# EAGLE design Grove Base Shield for NodeMCU v1.0 (EAGLE 6.4)
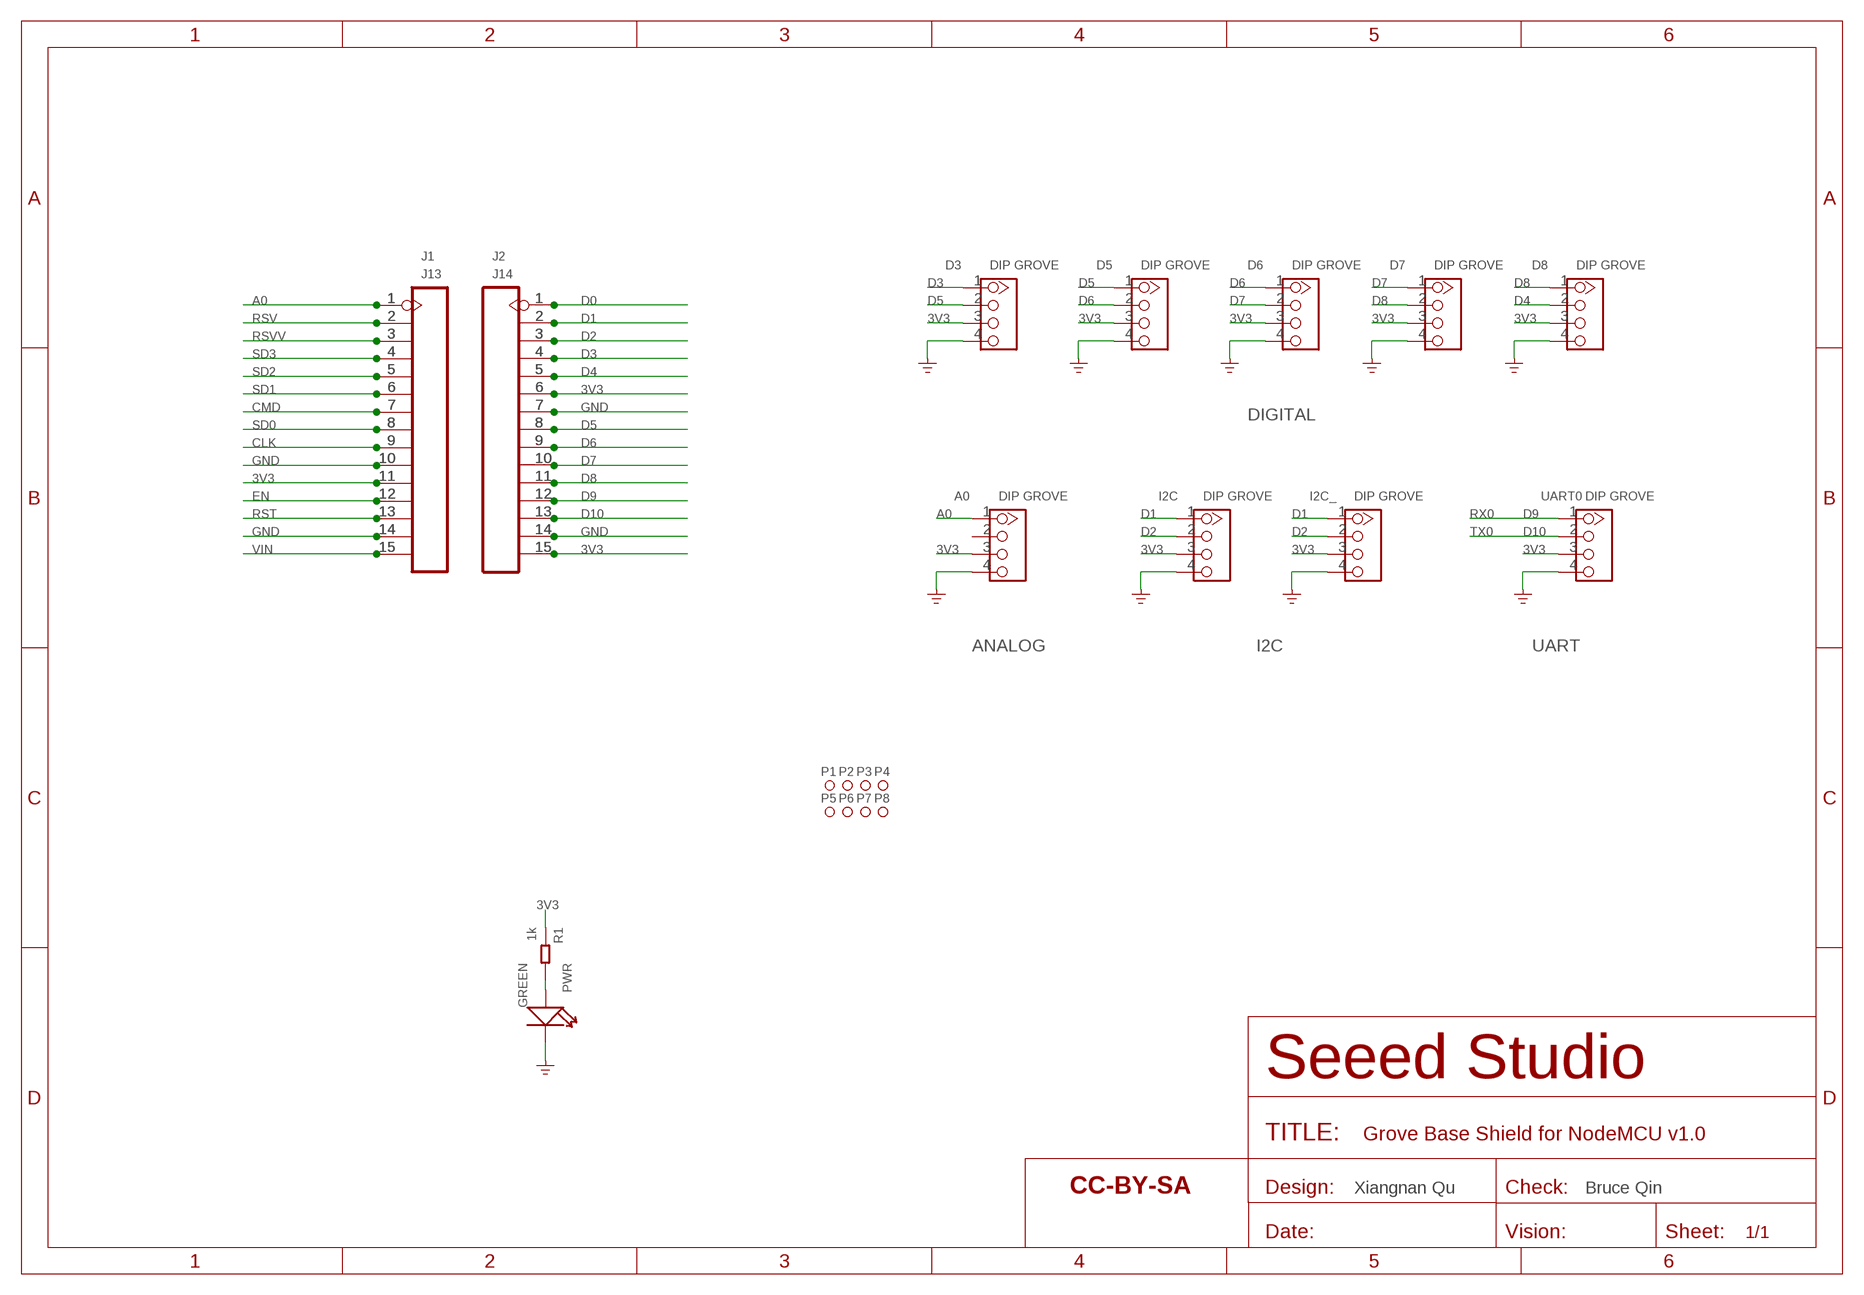
[diagram p0: schematic, sheet 1]

## Parts
A0  DIP GROVE  GROVE-CONNECTOR-DIP-2.0  [HW4-2.0]
D3  DIP GROVE  GROVE-CONNECTOR-DIP-2.0  [HW4-2.0]
D5  DIP GROVE  GROVE-CONNECTOR-DIP-2.0  [HW4-2.0]
D6  DIP GROVE  GROVE-CONNECTOR-DIP-2.0  [HW4-2.0]
D7  DIP GROVE  GROVE-CONNECTOR-DIP-2.0  [HW4-2.0]
D8  DIP GROVE  GROVE-CONNECTOR-DIP-2.0  [HW4-2.0]
I2C  DIP GROVE  GROVE-CONNECTOR-DIP-2.0  [HW4-2.0]
I2C_  DIP GROVE  GROVE-CONNECTOR-DIP-2.0  [HW4-2.0]
J1  HEADER-15P'2.54'  [H15-2.54]
J2  HEADER-15P'2.54'  [H15-2.54]
J13  HEADER-15P'2.54'  [H15-2.54]
J14  HEADER-15P'2.54'  [H15-2.54]
P1  MARK-1.0'ANNULAR'  [ROUND-MARK-1.0]
P2  MARK-1.0'ANNULAR'  [ROUND-MARK-1.0]
P3  MARK-1.0'ANNULAR'  [ROUND-MARK-1.0]
P4  MARK-1.0'ANNULAR'  [ROUND-MARK-1.0]
P5  MARK-1.0'ANNULAR'  [ROUND-MARK-1.0]
P6  MARK-1.0'ANNULAR'  [ROUND-MARK-1.0]
P7  MARK-1.0'ANNULAR'  [ROUND-MARK-1.0]
P8  MARK-1.0'ANNULAR'  [ROUND-MARK-1.0]
PWR  GREEN  LED'0603'  [LED-0603]
R1  1k  RES-0603  [R0603]
U$7  SEEEDSTUDIO-OPEN-SCH-FRAME  [SEEEDSTUDIO-PCB-FRAME]
UART0  DIP GROVE  GROVE-CONNECTOR-DIP-2.0  [HW4-2.0]

## Nets
3V3: A0.3 D3.3 D5.3 D6.3 D7.3 D8.3 I2C.3 I2C_.3 J1.11 J2.6 J2.15 J13.11 J14.6 J14.15 R1.1 UART0.3
A0: A0.1 J1.1 J13.1
CLK: J1.9 J13.9
CMD: J1.7 J13.7
D0: J2.1 J14.1
D1: I2C.1 I2C_.1 J2.2 J14.2
D2: I2C.2 I2C_.2 J2.3 J14.3
D3: D3.1 J2.4 J14.4
D4: D8.2 J2.5 J14.5
D5: D3.2 D5.1 J2.8 J14.8
D6: D5.2 D6.1 J2.9 J14.9
D7: D6.2 D7.1 J2.10 J14.10
D8: D7.2 D8.1 J2.11 J14.11
D9: J2.12 J14.12 UART0.1
D10: J2.13 J14.13 UART0.2
EN: J1.12 J13.12
GND: A0.4 D3.4 D5.4 D6.4 D7.4 D8.4 I2C.4 I2C_.4 J1.10 J1.14 J2.7 J2.14 J13.10 J13.14 J14.7 J14.14 PWR.- UART0.4 ; supply symbol labelled GND_POWER
N$1: PWR.+ R1.2
RST: J1.13 J13.13
RSV: J1.2 J13.2
RSVV: J1.3 J13.3
SD0: J1.8 J13.8
SD1: J1.6 J13.6
SD2: J1.5 J13.5
SD3: J1.4 J13.4
VIN: J1.15 J13.15
Unconnected: A0.2

## Notes on the sheet
- DIGITAL
- RX0
- TX0
- ANALOG | I2C | UART
- Xiangnan Qu | Bruce Qin

## Library data of the parts
A0 D3 D5-D8 I2C I2C_ UART0 = Connector-new:GROVE-CONNECTOR-DIP: 4P-2.0:320110033;4P-2.0-90D:320110034
J1 J2 J13 J14 = Connector-new:HEADER-15P: Header 15 Standard 15-pin 0.1" header. Use with straight break away headers (SKU : PRT-00116), right angle break away headers (PRT-00553), swiss pins (PRT-00743), machine pins (PRT-00117), and female headers (PRT-00115).
P1-P8 = Discrete-new:MARK-1.0; PARTNO: DNP
PWR = Discrete-new:LED
R1 = Discrete-new:RES
U$7 = moudle-new:SEEEDSTUDIO-OPEN-SCH-FRAME

## Board
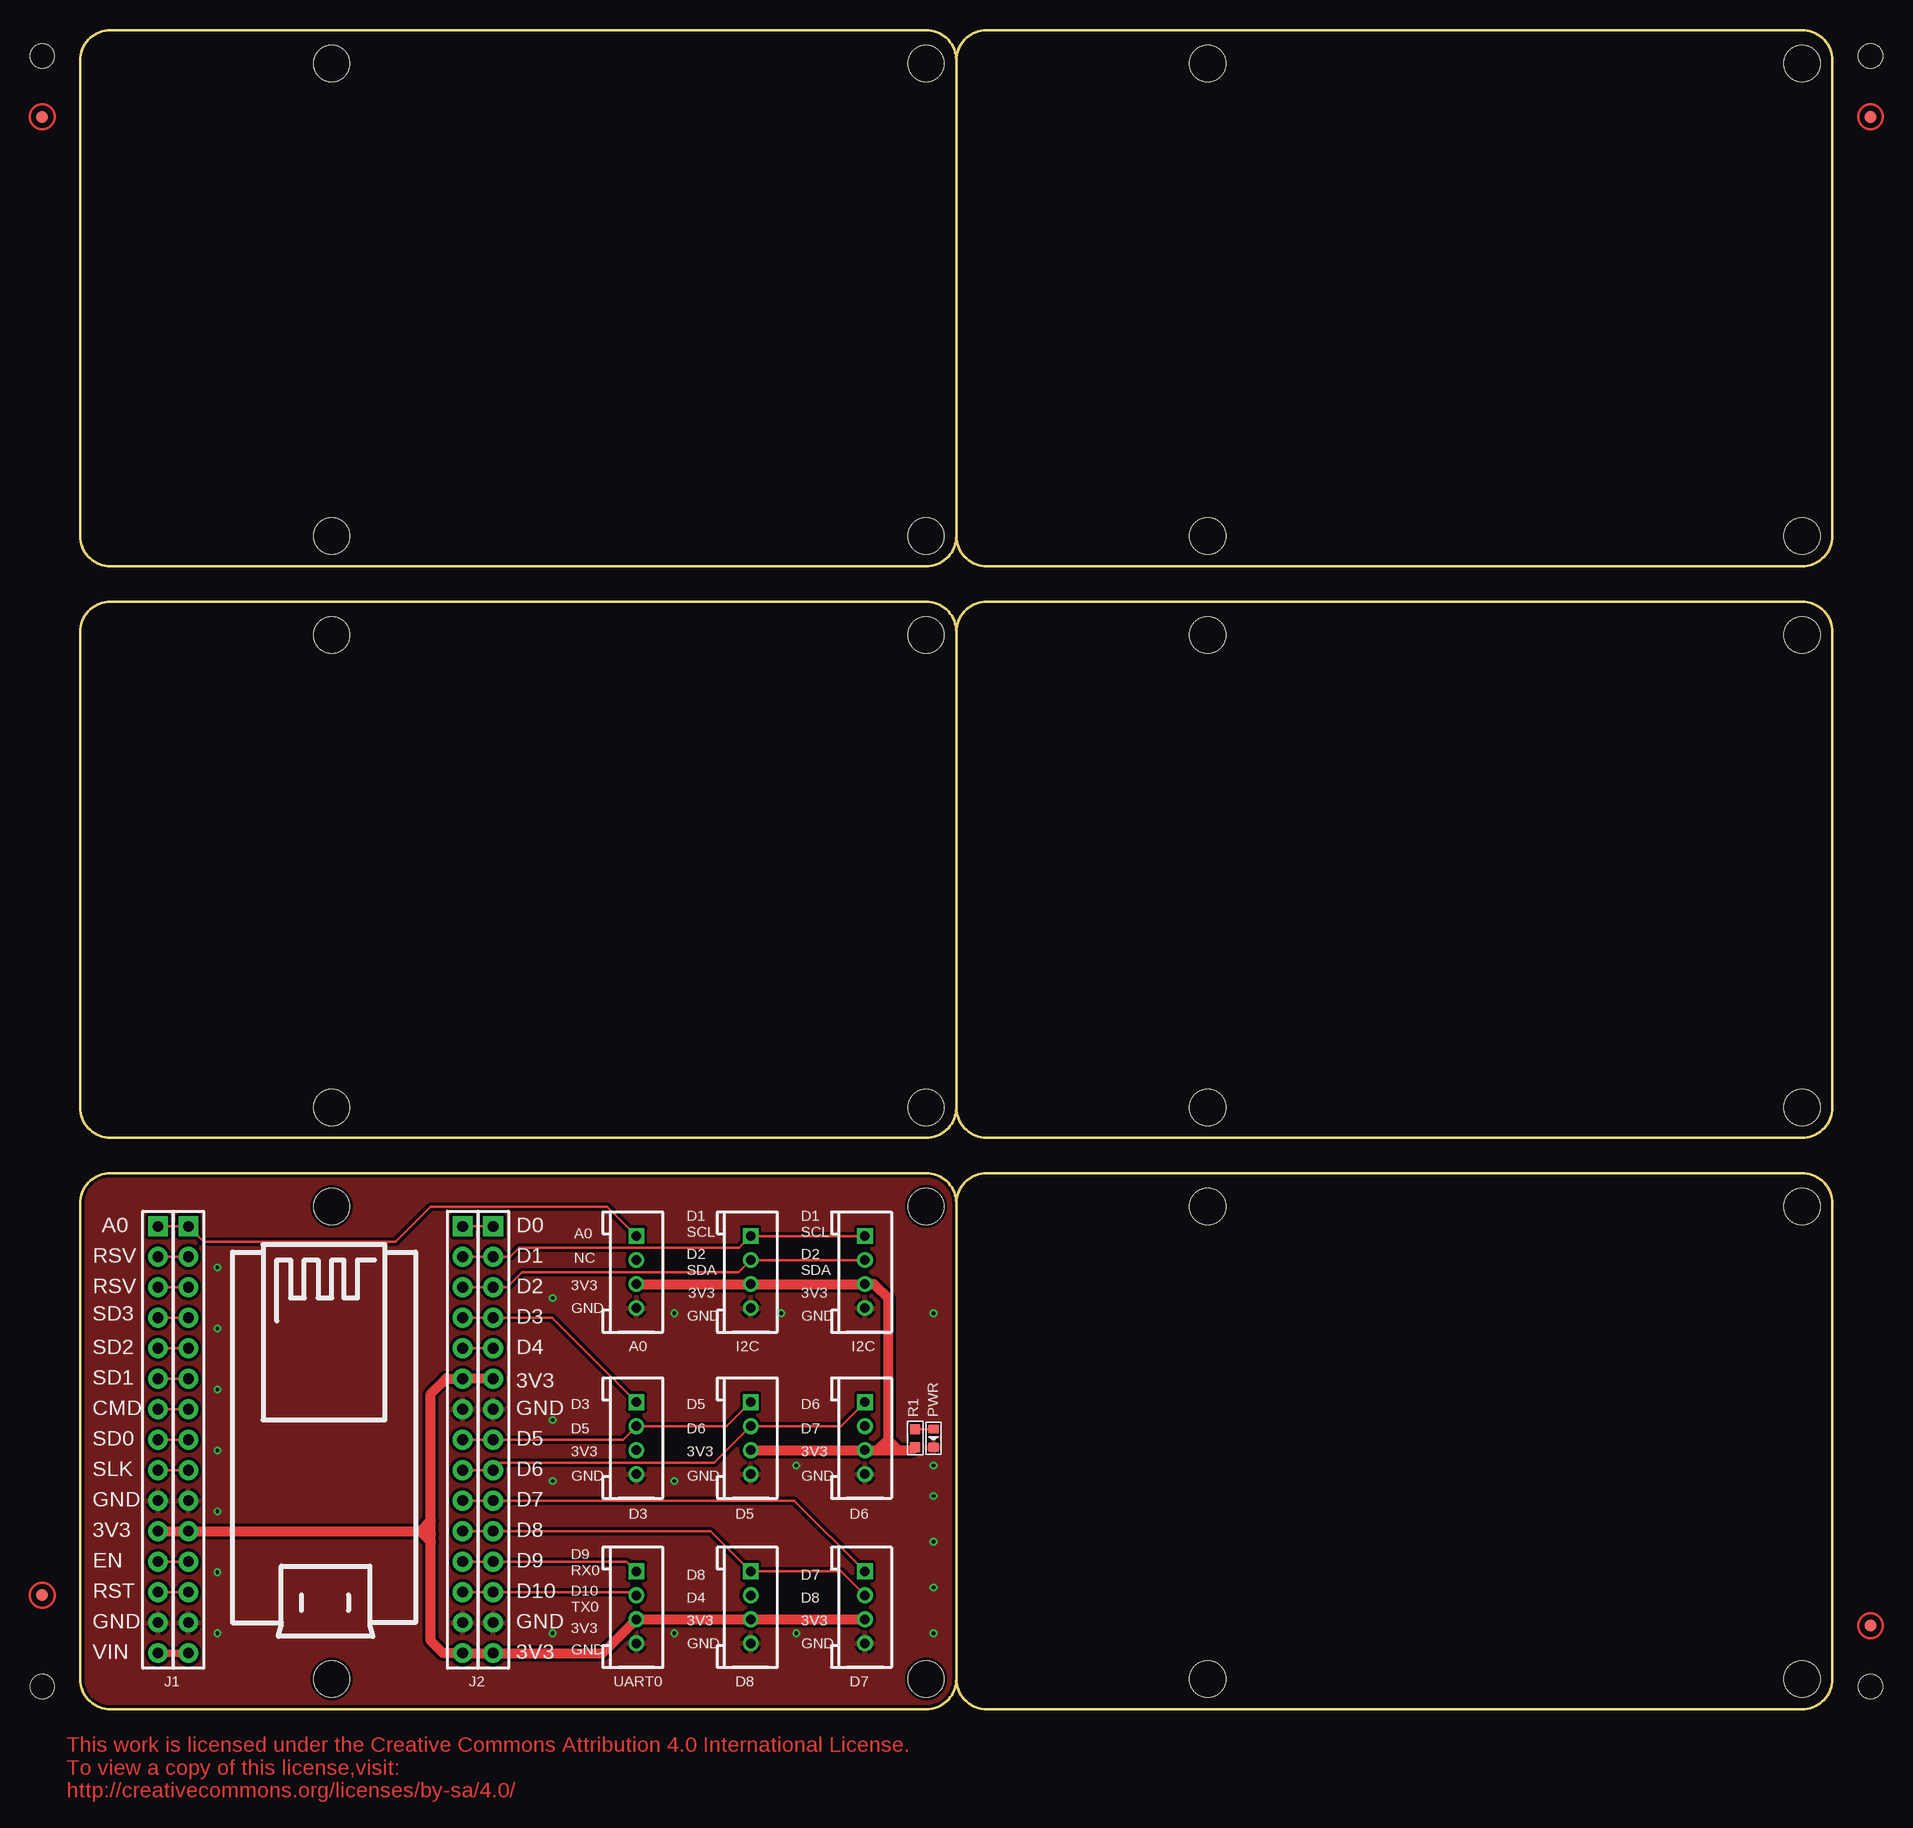
[diagram p1: board, top side]
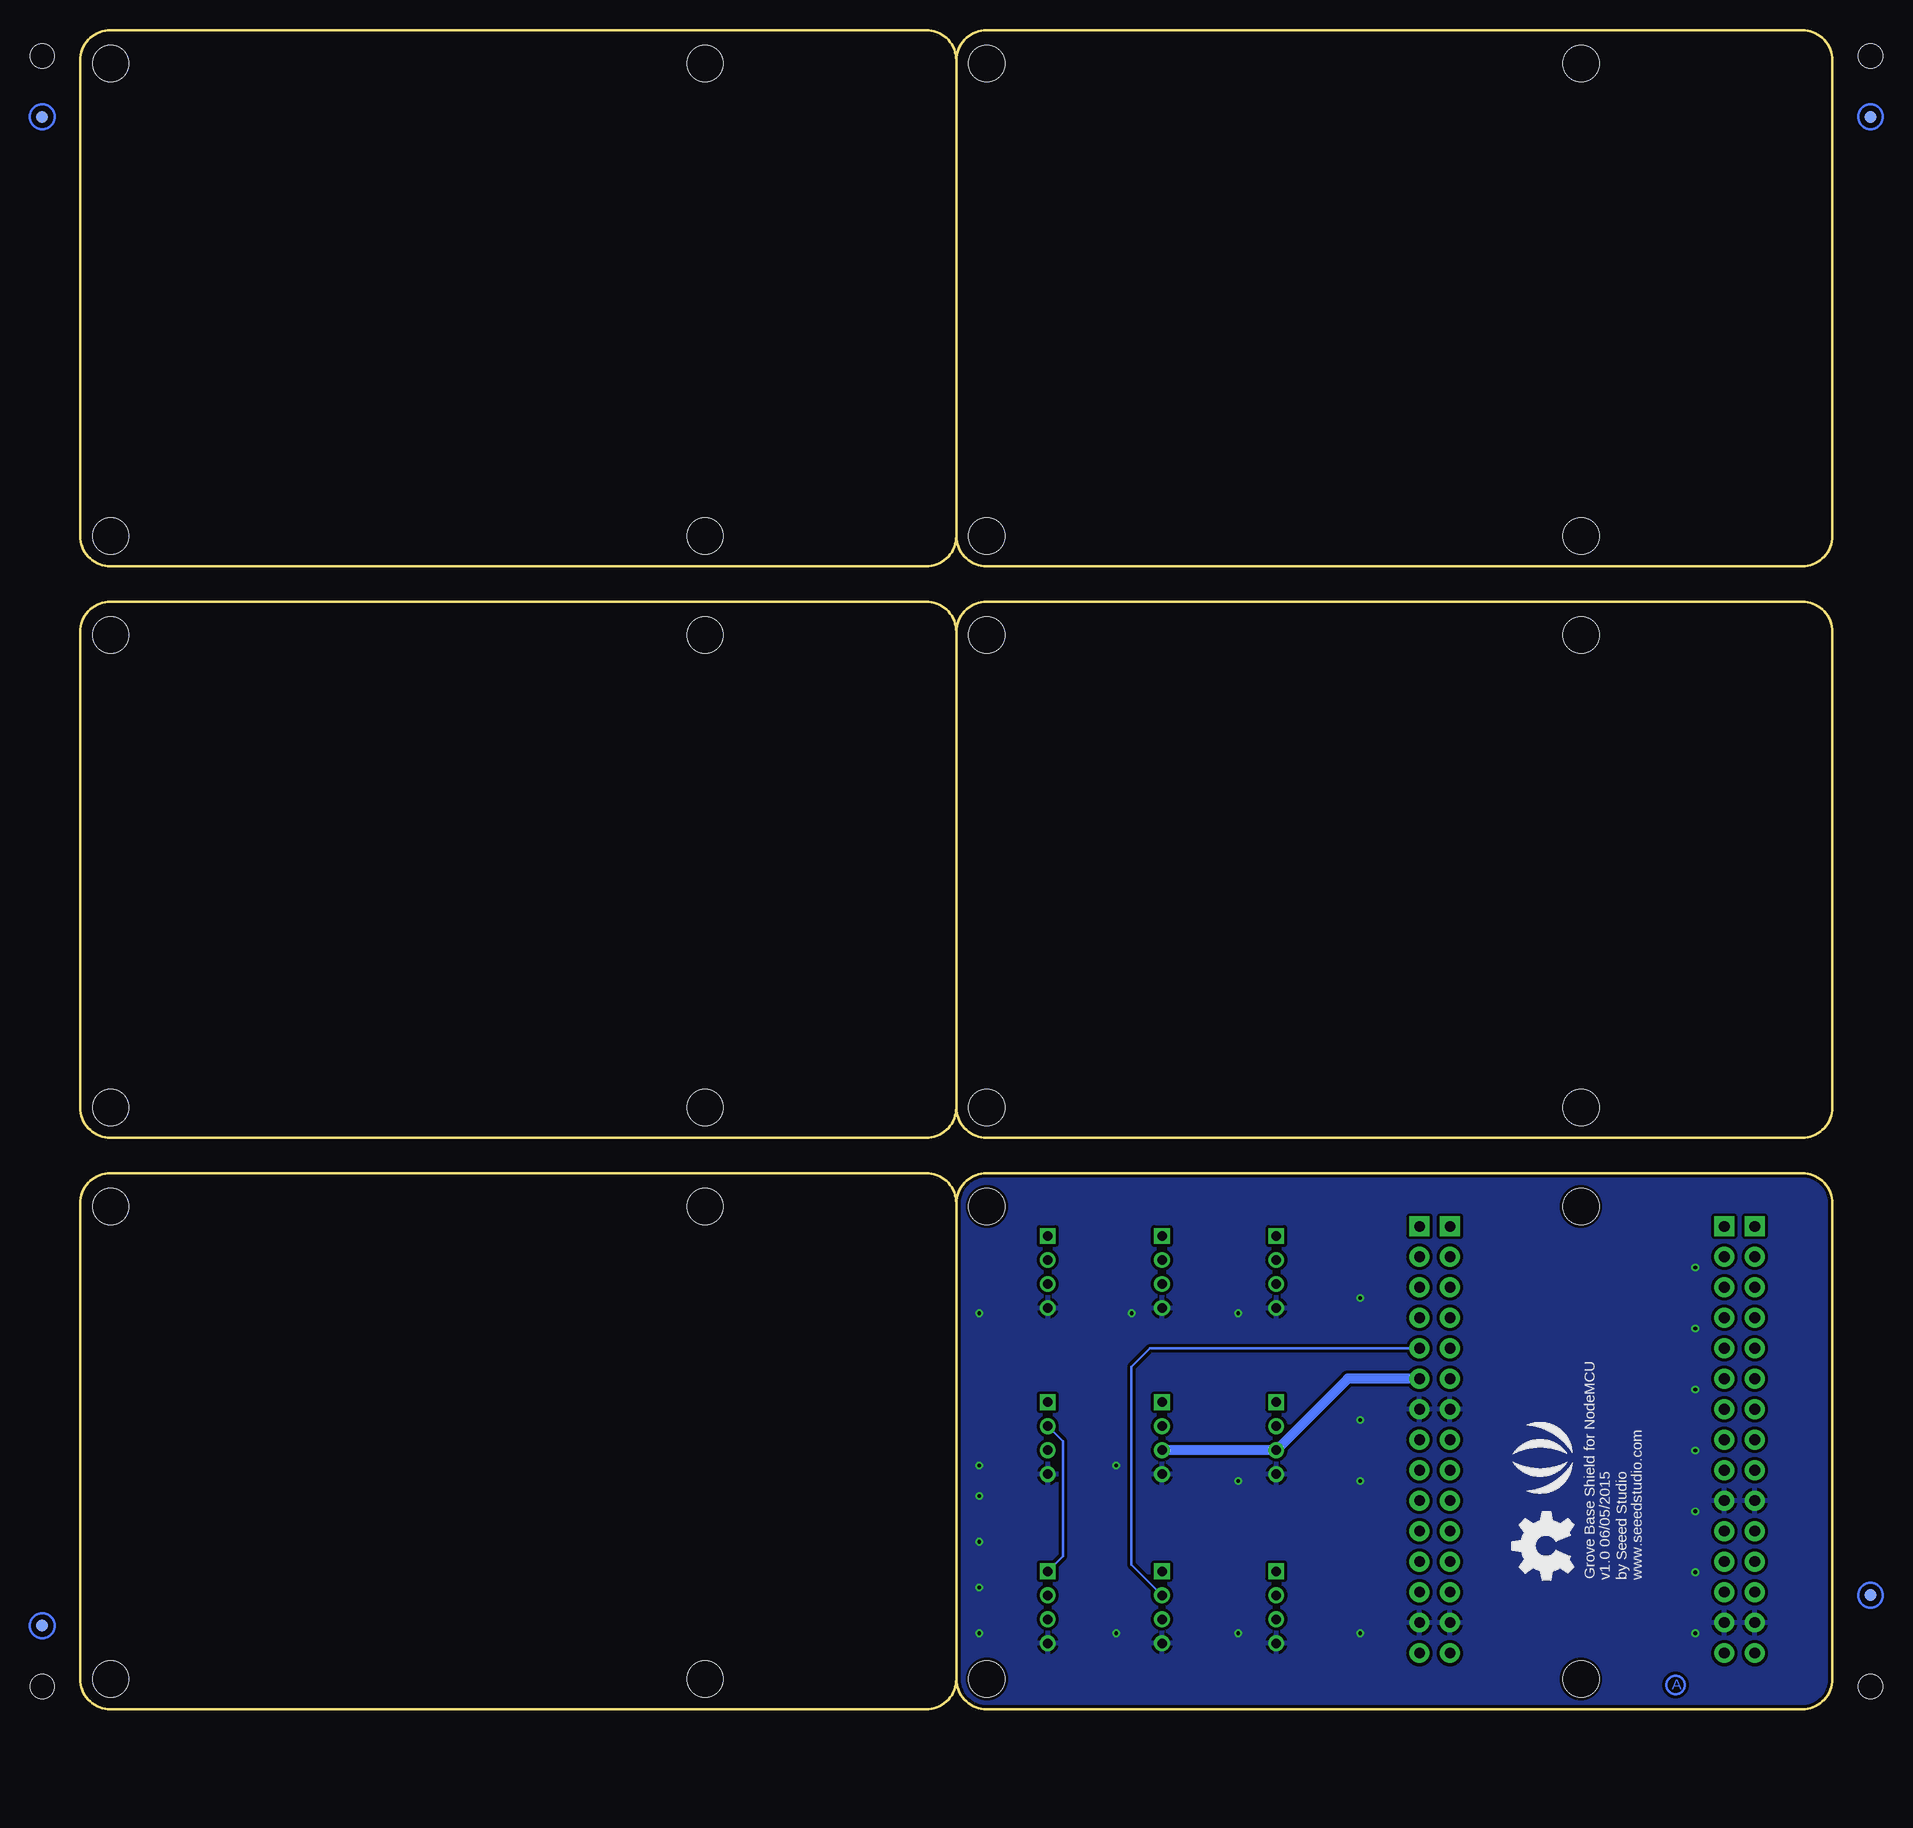
[diagram p2: board, bottom side, seen from below]

Size 146.05 x 139.95 mm. Coordinates in mm from the lower left corner, seen from the top.
Outline: 73.03,42.16 arc90 70.48,44.7 2.54,44.7 arc90 0,42.16 0,2.54 arc90 2.54,0 70.48,0 arc90 73.03,2.54
Outline: 73.03,2.54 arc90 75.56,0 143.51,0 arc90 146.05,2.54 146.05,42.16 arc90 143.51,44.7 75.56,44.7 arc90 73.03,42.16
Outline: 73.03,2.54 73.03,42.16
Outline: 73.03,89.79 arc90 70.48,92.33 2.54,92.33 arc90 0,89.79 0,50.16 arc90 2.54,47.62 70.48,47.62 arc90 73.03,50.16
Outline: 73.03,50.16 arc90 75.56,47.62 143.51,47.62 arc90 146.05,50.16 146.05,89.79 arc90 143.51,92.33 75.56,92.33 arc90 73.03,89.79
Outline: 73.03,50.16 73.03,89.79
Outline: 73.03,137.41 arc90 70.48,139.95 2.54,139.95 arc90 0,137.41 0,97.79 arc90 2.54,95.25 70.48,95.25 arc90 73.03,97.79
Outline: 73.03,97.79 arc90 75.56,95.25 143.51,95.25 arc90 146.05,97.79 146.05,137.41 arc90 143.51,139.95 75.56,139.95 arc90 73.03,137.41
Outline: 73.03,97.79 73.03,137.41
Copper layers (1*16): Top 0.035mm / dielectric 1.5mm / Bottom 0.035mm
Design rules "SeeedStudio_2layer_DRU_no_angle_20140221 *": minimum track width 6mil, minimum drill 12mil, track to track 6mil, track to pad 6mil, pad to pad 6mil, via to via 6mil, smd to smd 0mil, copper to edge 10mil, drill to drill 10mil, minimum pad ring 10mil, minimum via ring 6mil, stop-mask expansion 2mil, vias tented up to drill 25mil, thermal gap 10mil
Holes 3 mm at 20.95,41.91 20.95,2.54 70.48,41.91 70.48,2.54 93.98,41.91 93.98,2.54 143.51,41.91 143.51,2.54 20.95,89.53 20.95,50.16 70.48,89.53 70.48,50.16 93.98,89.53 93.98,50.16 143.51,89.53 143.51,50.16 20.95,137.16 20.95,97.79 70.48,137.16 70.48,97.79 93.98,137.16 93.98,97.79 143.51,137.16 143.51,97.79
Holes 2 mm at -3.17,1.91 -3.17,137.79 149.22,137.79 149.22,1.91

### Footprints (pad centres in the part's own frame; a part is rotated, then mirrored left to right if it is on the bottom)
HW4-2.0 = drill 0.8 pad 1.27 square: 1 -3,0 | drill 0.8 pad 1.27: 2 -1,0; 3 1,0; 4 3,0
H15-2.54 = drill 0.889 pad 1.651 square: 1 0,-17.78 | drill 0.889 pad 1.651: 2 0,-15.24; 3 0,-12.7; 4 0,-10.16; 5 0,-7.62; 6 0,-5.08; 7 0,-2.54; 8 0,0; 9 0,2.54; 10 0,5.08; 11 0,7.62; 12 0,10.16; 13 0,12.7; 14 0,15.24; 15 0,17.78
ROUND-MARK-1.0 = smd 1.016 x 1.016: P$1 0,0
LED-0603 = smd 0.762 x 0.889: + -0.762,0; - 0.762,0
R0603 = smd 0.889 x 0.889: 1 0,0.762; 2 0,-0.762

### Placement (x,y rotation side)
A0  46.35,36.45 270 top
D3  46.35,22.61 270 top
D5  55.88,22.61 270 top
D6  65.41,22.61 270 top
D7  65.41,8.51 270 top
D8  55.88,8.51 270 top
I2C  55.88,36.45 270 top
I2C_  65.41,36.45 270 top
J1  6.48,22.48 180 top
J2  31.88,22.48 180 top
J13  9.02,22.48 180 top
J14  34.42,22.48 180 top
P1  149.22,132.72 0 top  (outside the outline)
P2  149.22,132.72 0 bottom  (outside the outline)
P3  149.22,6.99 0 top  (outside the outline)
P4  149.22,6.99 0 bottom  (outside the outline)
P5  -3.17,132.72 0 top  (outside the outline)
P6  -3.17,132.72 0 bottom  (outside the outline)
P7  -3.17,9.53 0 top  (outside the outline)
P8  -3.17,9.53 0 bottom  (outside the outline)
PWR  71.12,22.61 270 top
R1  69.6,22.61 180 top
U$7  -1.14,-7.37 0 top  (outside the outline)
U$27  [OSHW_FILLX200_NOTEXT]  21.59,10.79 90 bottom
U$29  [SEEED-SILK-280*268MIL]  23.37,20.95 90 bottom
UART0  46.35,8.51 270 top

### Tracks (layer width: path | path; a pad name or v marks a point on that pad's centre or on a via)
3V3
  Top 0.813: J1.11 J13.11 28.32,14.86 | 28.32,14.86 28.96,14.86 29.21,14.61 | 29.21,13.97 29.21,5.71 30.23,4.7 J2.15 J14.15 43.55,4.7 UART0.3 D8.3 D7.3 | 29.21,13.97 29.21,14.61 | 29.21,14.61 29.21,15.75 | 29.21,15.75 29.21,26.29 30.48,27.56 J2.6 J14.6 | 28.32,14.86 29.21,15.75 | 28.32,14.86 29.21,13.97 | D5.3 D6.3 67.44,21.61 | A0.3 I2C.3 I2C_.3 66.15,35.45 67.31,34.29 67.31,22.48 | 67.44,21.61 69.36,21.61 R1.1 | 67.31,22.48 67.31,21.73 67.44,21.61 | 67.31,22.48 66.55,21.72 | 67.31,22.48 68.07,21.72
  Bottom 0.813: J14.6 40.4,27.56 D3.3 D5.3
A0
  Top 0.203: J1.1 J13.1 10.29,38.99 26.29,38.99 29.21,41.91 43.89,41.91 A0.1
CLK
  Top 0.203: J1.9 J13.9
CMD
  Top 0.203: J1.7 J13.7
D0
  Top 0.203: J2.1 J14.1
D1
  Top 0.203: J2.2 J14.2 35.81,37.72 36.58,38.48 54.91,38.48 I2C.1 I2C_.1
D2
  Top 0.203: J2.3 J14.3 35.56,35.18 36.83,36.45 54.88,36.45 I2C.2 I2C_.2
D3
  Top 0.203: J2.4 J14.4 39.32,32.64 D3.1
D4
  Top 0.203: J14.5 J2.5
  Bottom 0.203: J14.5 56.9,30.1 58.42,28.57 58.42,12.05 D8.2
D5
  Top 0.203: J2.8 J14.8 45.23,22.48 D3.2 53.88,23.61 D5.1
D6
  Top 0.203: J2.9 J14.9 35.05,20.57 52.85,20.57 D5.2 63.41,23.61 D6.1
D7
  Top 0.203: J2.10 J14.10 59.52,17.4 D7.1
  Bottom 0.203: D6.2 65.39,23.61 64.14,22.35 64.14,12.78 D7.1
D8
  Top 0.203: J2.11 J14.11 52.53,14.86 D8.1 63.41,11.51 D7.2
D9
  Top 0.203: J2.12 J14.12 45.55,12.32 UART0.1
D10
  Top 0.203: J2.13 J14.13 46.09,9.78 UART0.2
EN
  Top 0.203: J1.12 J13.12
GND  (via drill 0.3 pad 0.64)
  other vias: 71.12,20.32 71.12,6.35 71.12,13.97 71.12,10.16 71.12,17.78 59.69,6.35 49.53,6.35 59.69,20.32 49.53,19.05 71.12,33.02 58.42,33.02 49.53,33.02 39.37,19.05 39.37,24.13 39.37,34.29 39.37,6.35 11.43,6.35 11.43,16.51 11.43,11.43 11.43,21.59 11.43,26.67 11.43,31.75 11.43,36.83
  pour Top (isolate 0.254, rank 6): -0.64,45.72 73.66,45.72 73.66,-0.64 -0.64,-0.64
  pour Bottom (isolate 0.254, rank 6): -0.64,45.72 73.66,45.72 73.66,-0.64 -0.64,-0.64
N$1
  Top 0.203: R1.2 PWR.+
RST
  Top 0.203: J1.13 J13.13
RSV
  Top 0.203: J1.2 J13.2
RSVV
  Top 0.203: J1.3 J13.3
SD0
  Top 0.203: J1.8 J13.8
SD1
  Top 0.203: J1.6 J13.6
SD2
  Top 0.203: J1.5 J13.5
SD3
  Top 0.203: J1.4 J13.4
VIN
  Top 0.61: J1.15 J13.15
(copper drawn outside any net)
  shapes: Bottom circle x1

### Text on the board
Bottom: A
bPlace: www.seeedstudio.com | by Seeed Studio | v1.0 06/05/2015 | Grove Base Shield for NodeMCU
tNames: A0 | D0 | A0 | D1 / SCL | D1 / SCL | RSV | D1 | NC | D2 / SDA | D2 / SDA | RSV | D2 | 3V3 | 3V3 | 3V3 | GND | SD3 | D3 | GND | GND | SD2 | D4 | I2C | SD1 | 3V3 | CMD | GND | D3 | D5 | D6 | D5 | D6 | D7 | SD0 | D5 | 3V3 | 3V3 | 3V3 | SLK | D6 | GND | GND | GND | GND | D7 | 3V3 | D8 | EN | D9 | D9 / RX0 | D8 | D7 | RST | D10 | D4 | D8 | D10 / TX0 | GND | GND | 3V3 | 3V3 | 3V3 | GND | GND | GND | VIN | 3V3